# Altium schematic sheet PD.SchDoc
size A0; SheetNumber: 3; SheetTotal: 6
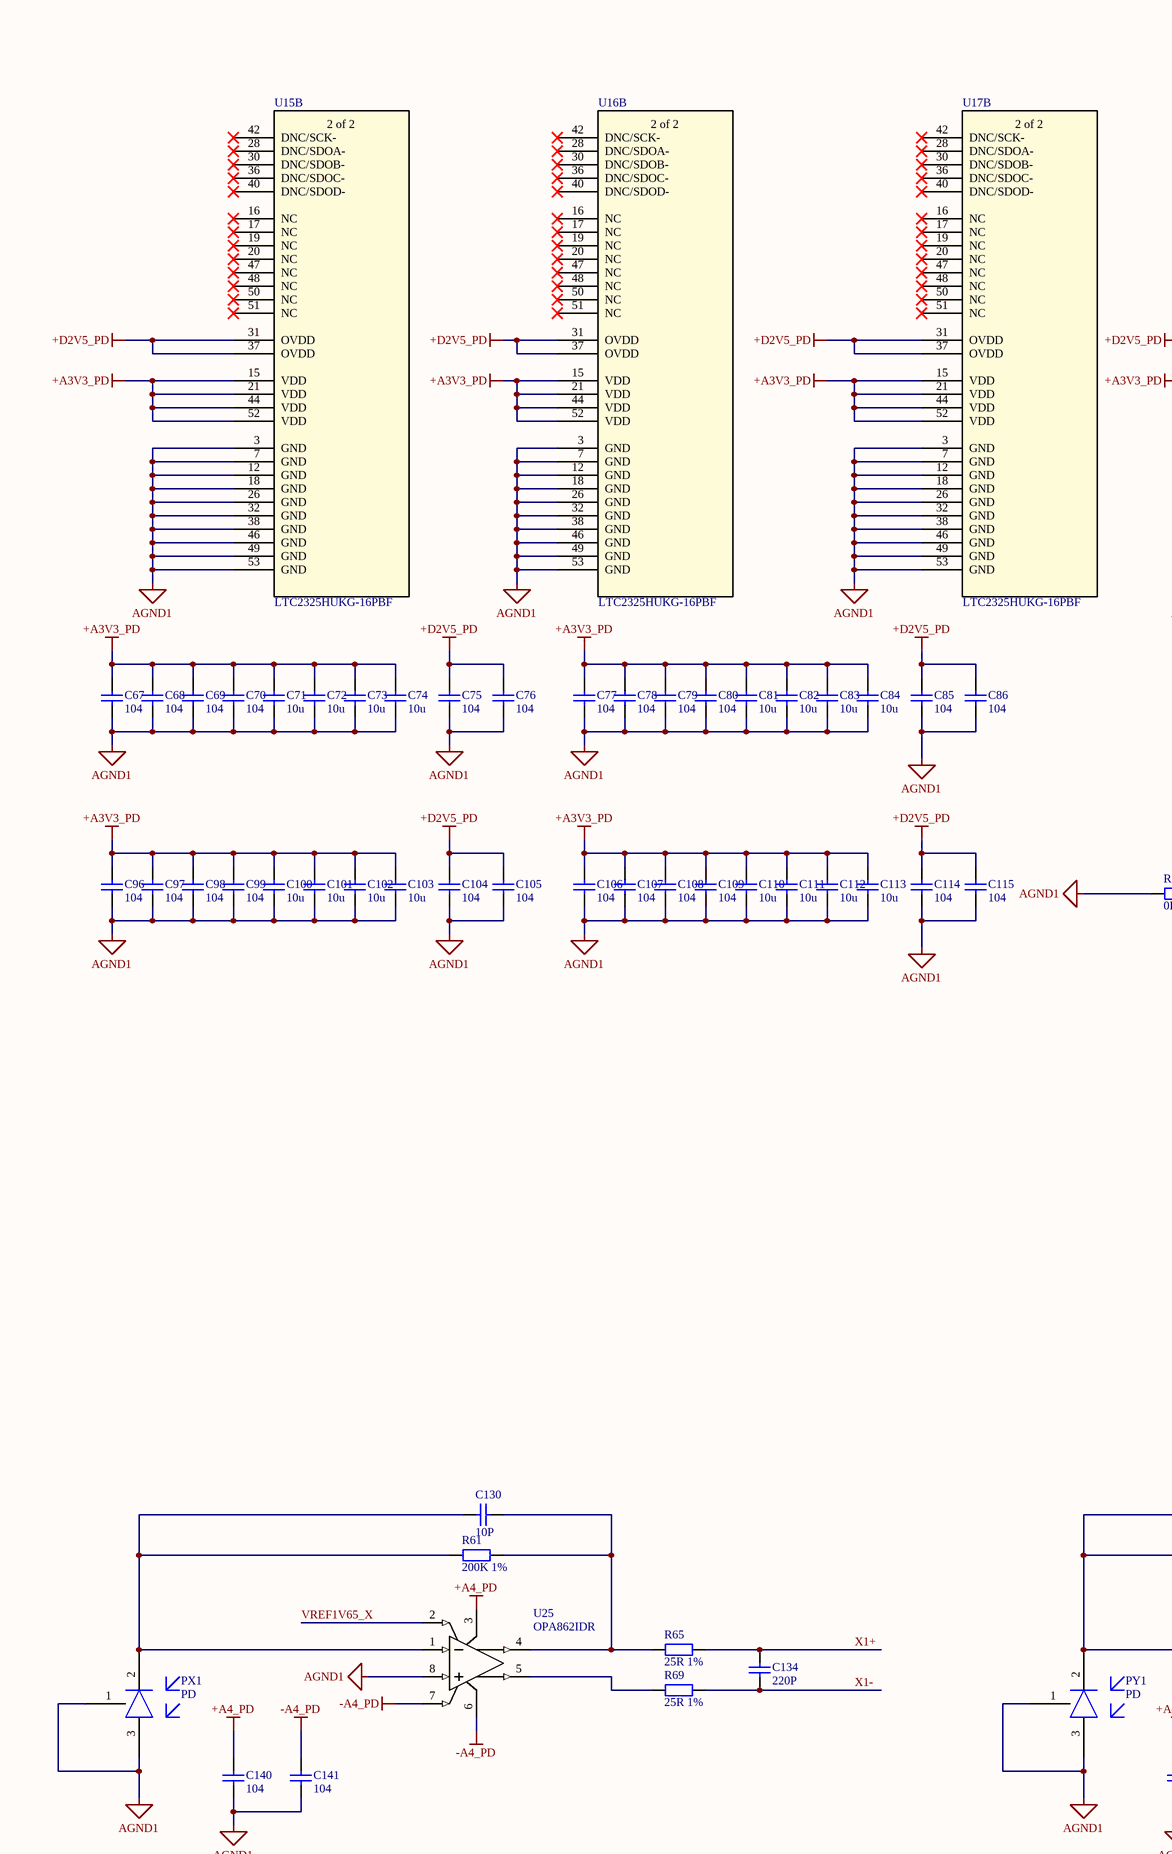
[diagram p0: PD.SchDoc, top left]
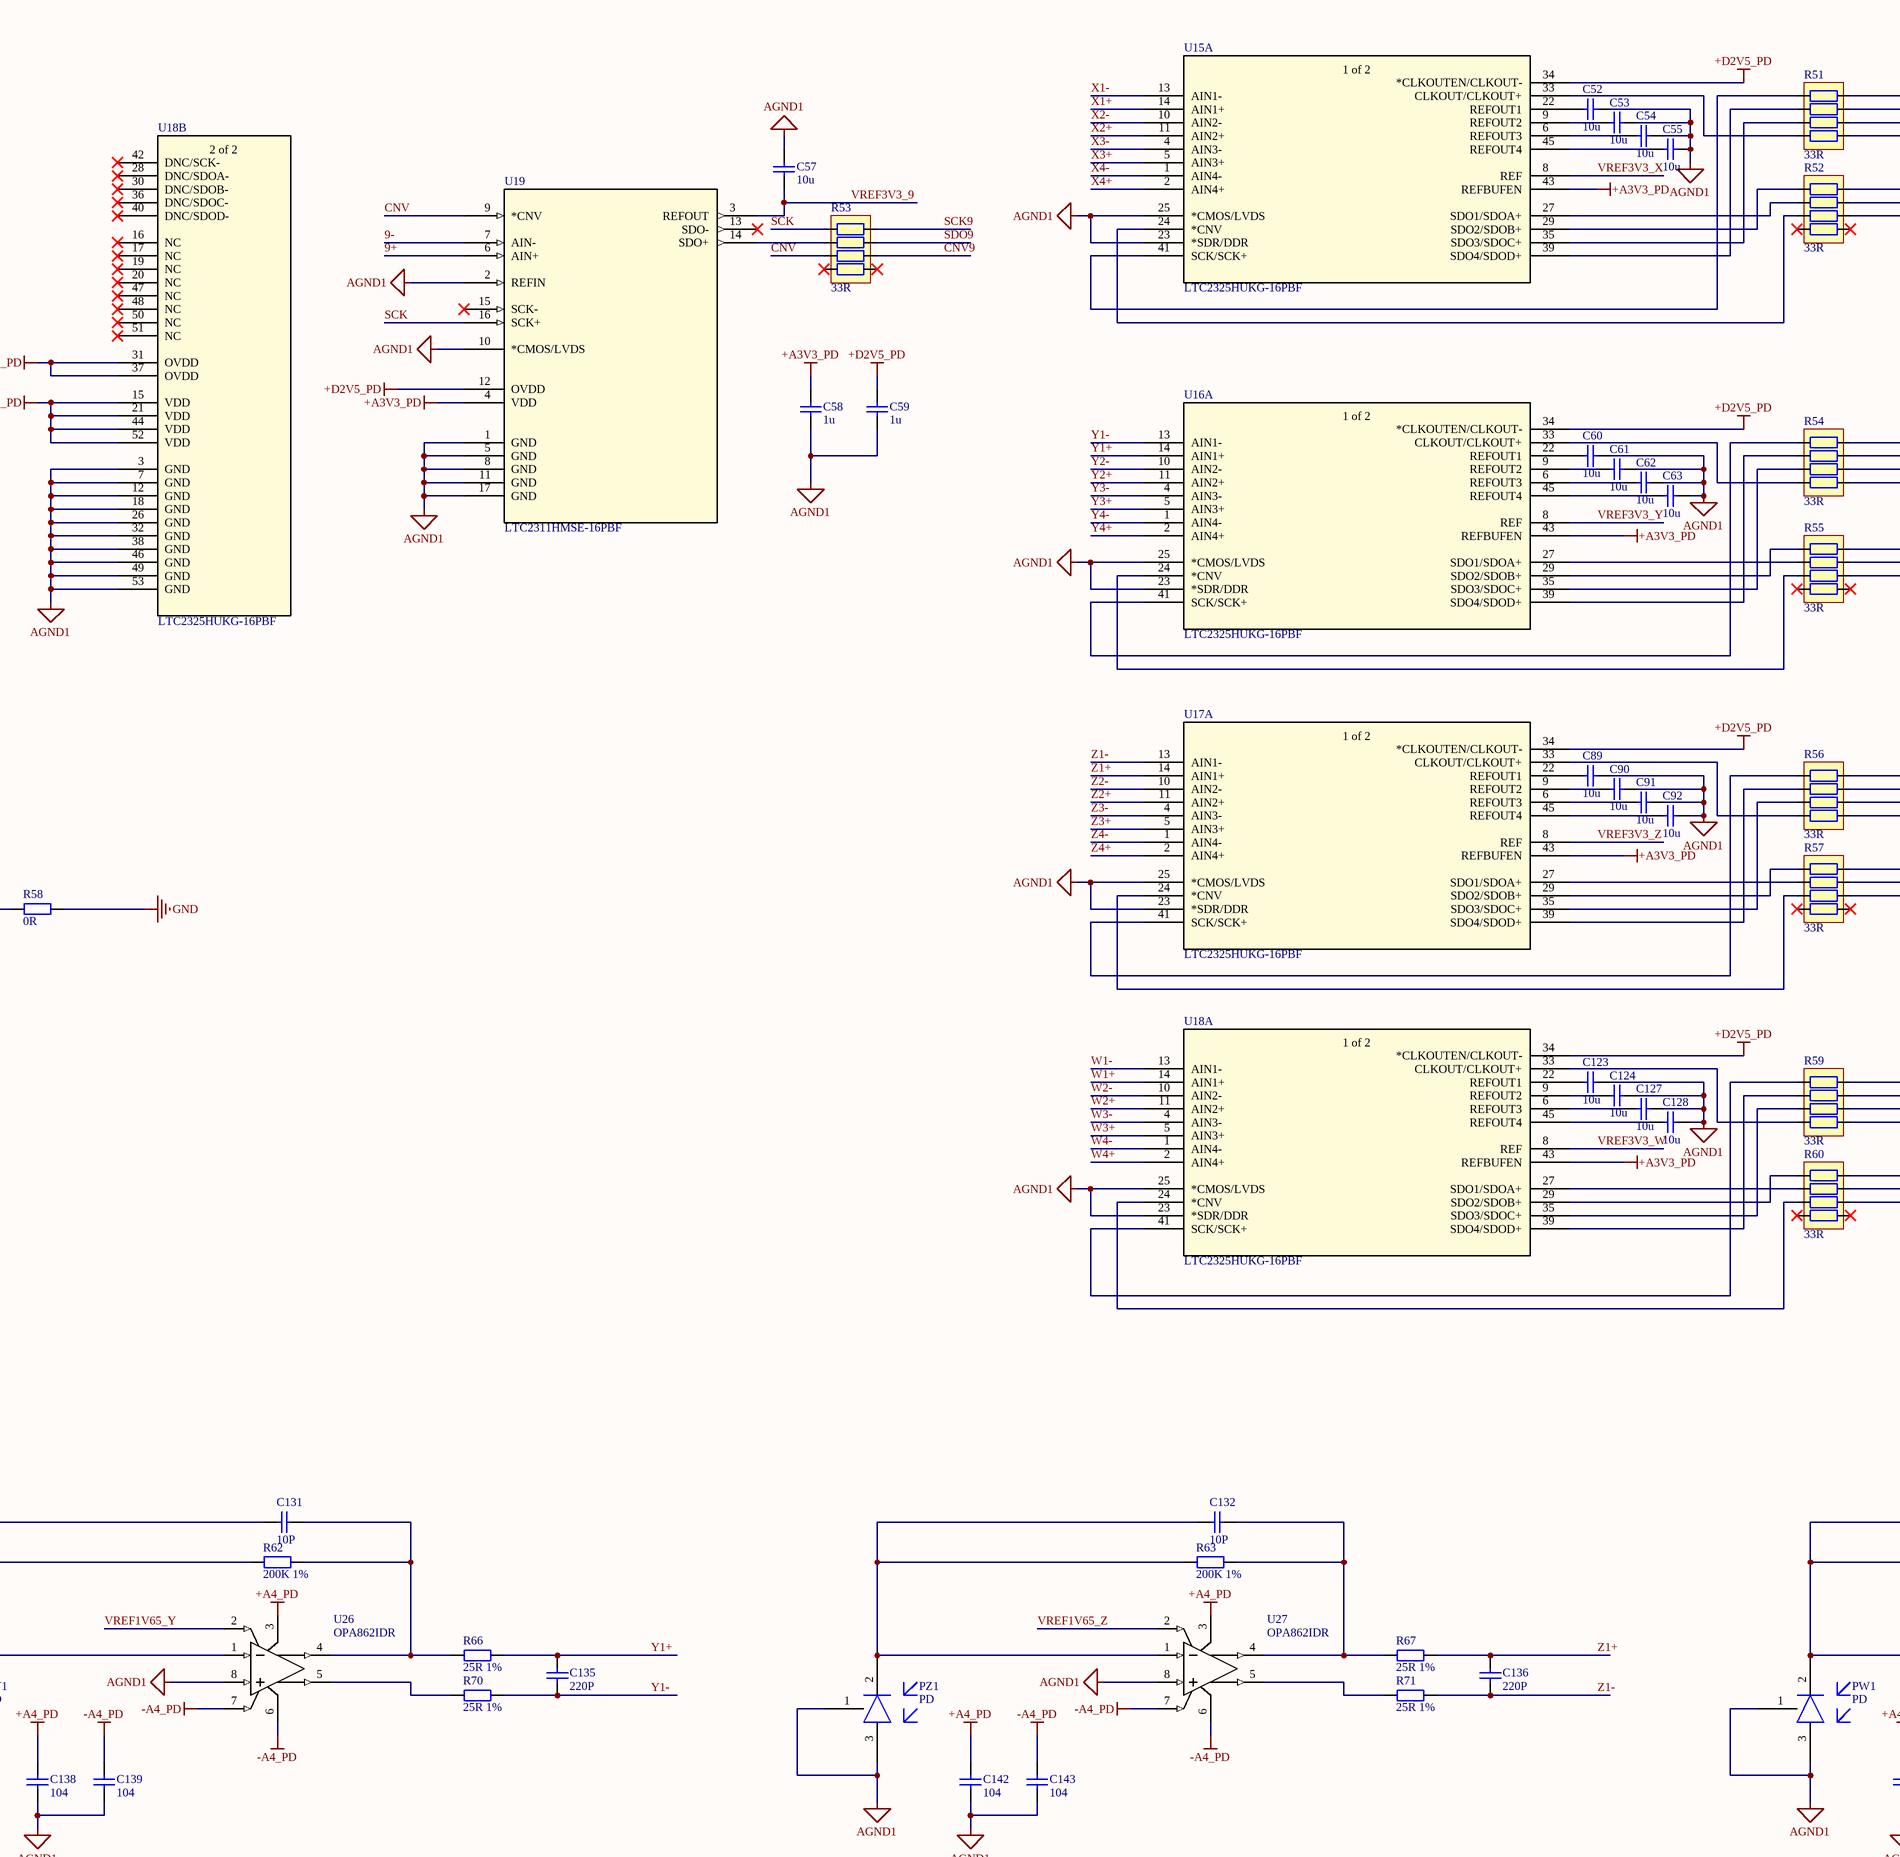
[diagram p1: PD.SchDoc, top middle]
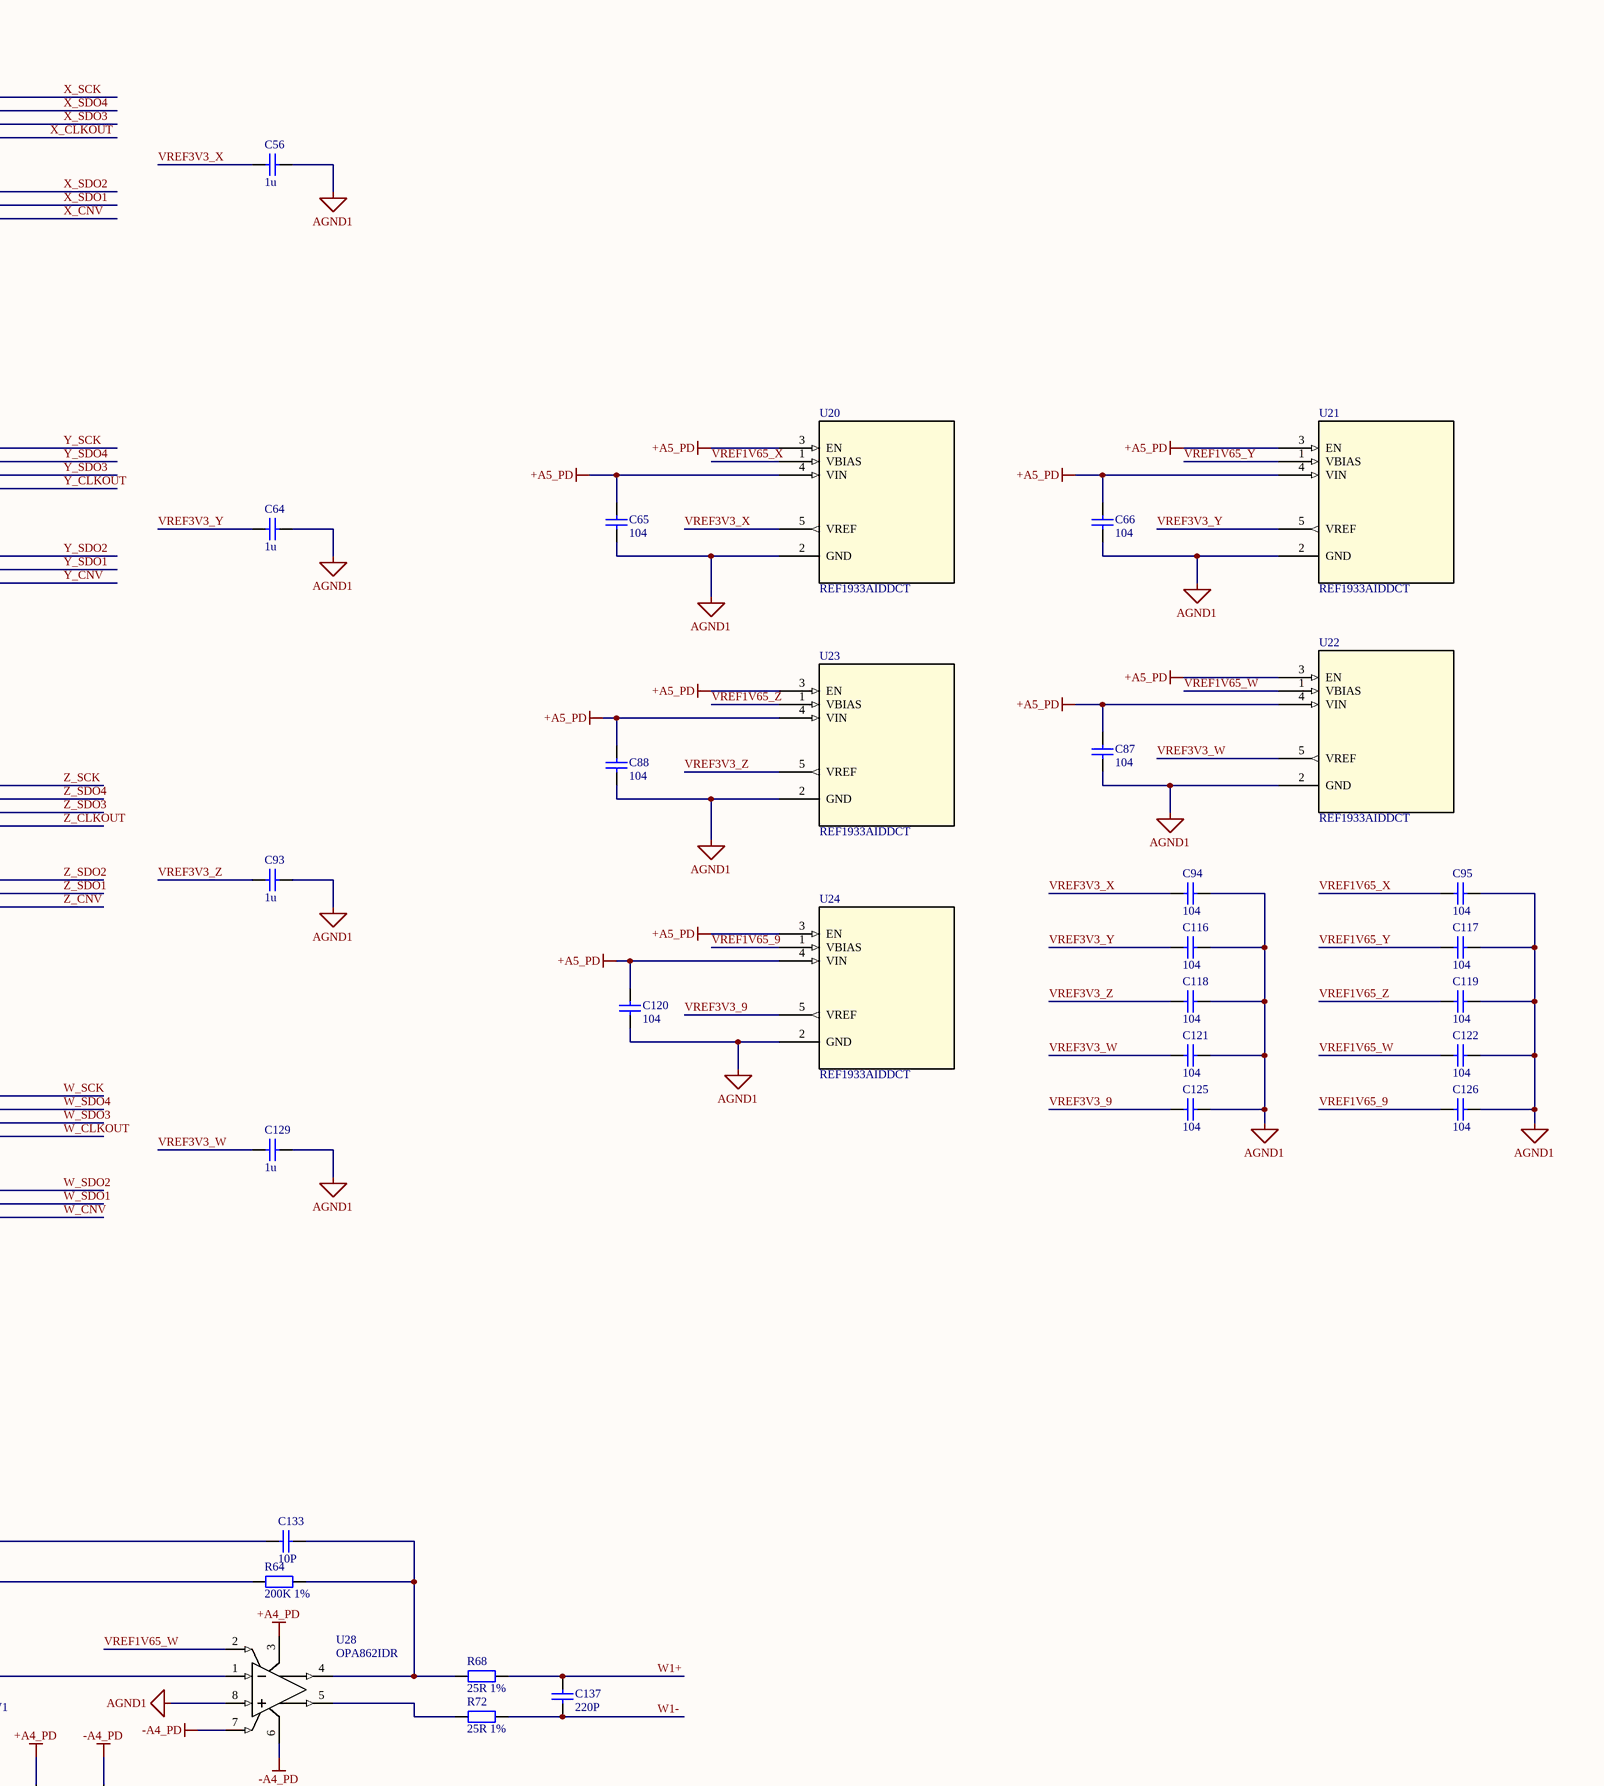
[diagram p2: PD.SchDoc, top right]
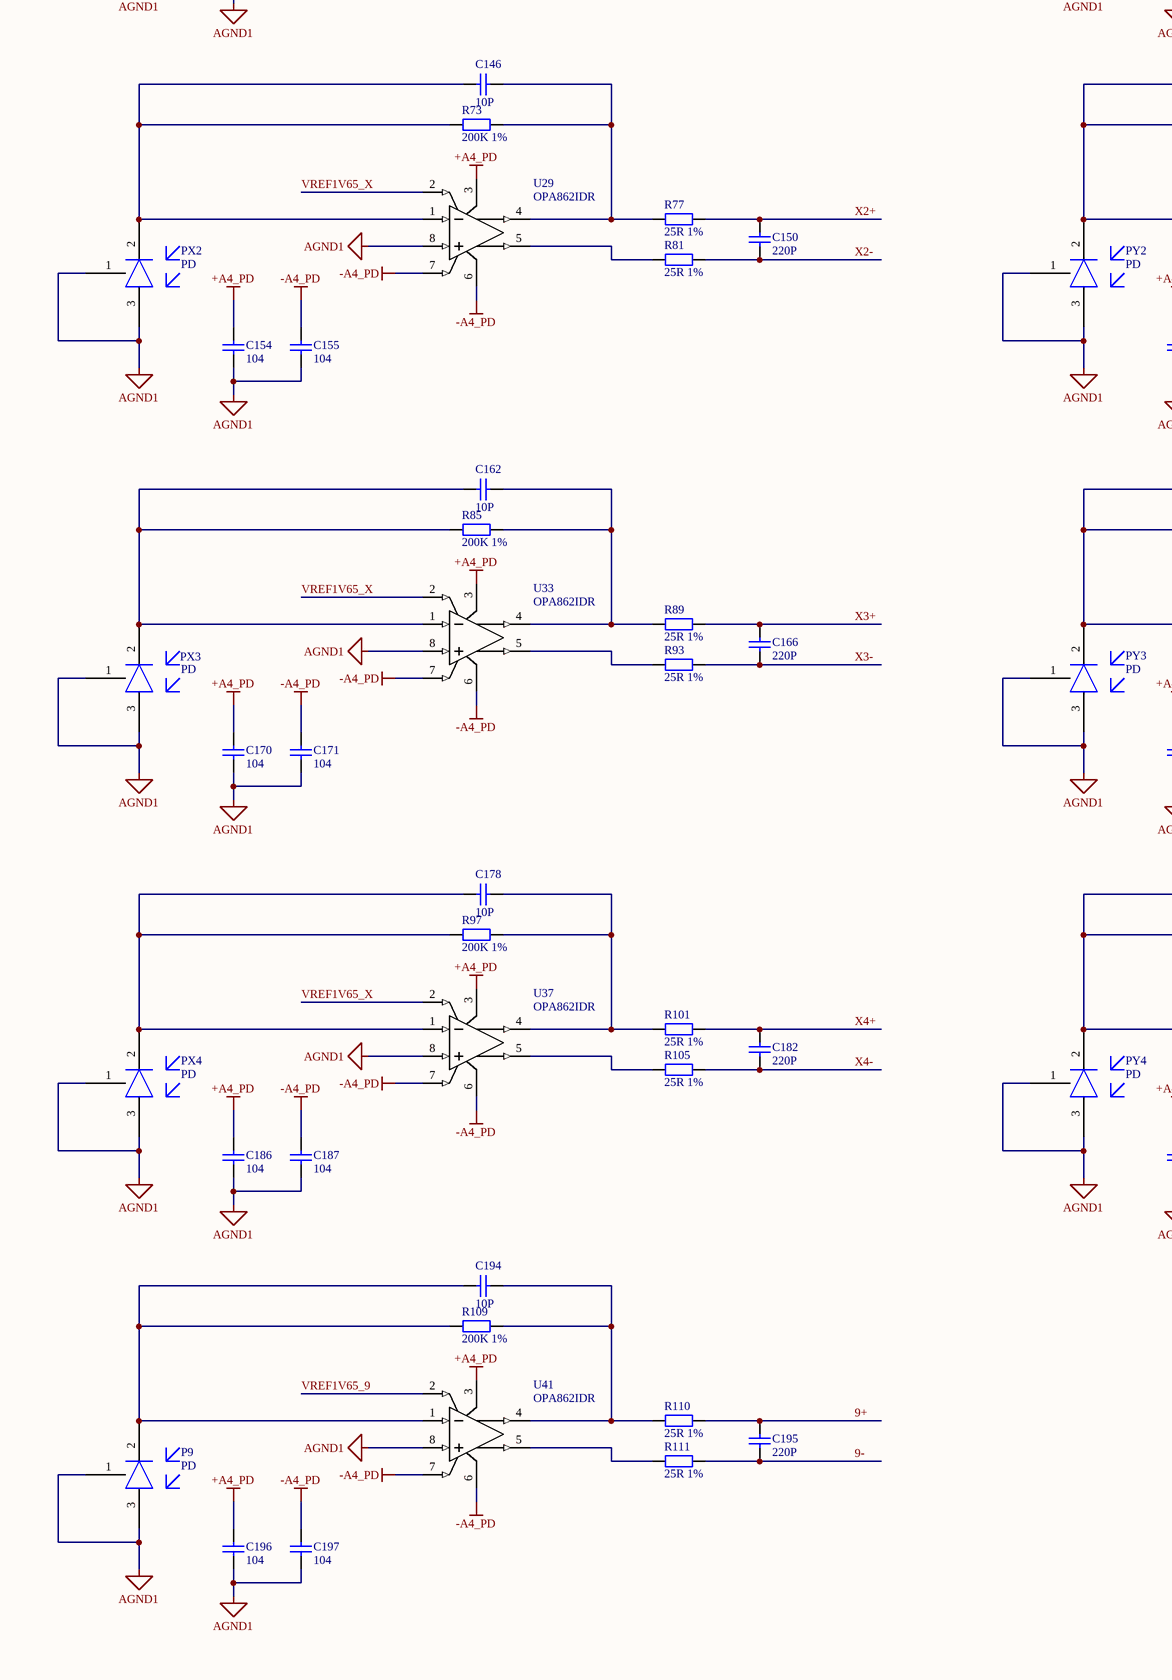
[diagram p3: PD.SchDoc, bottom left]
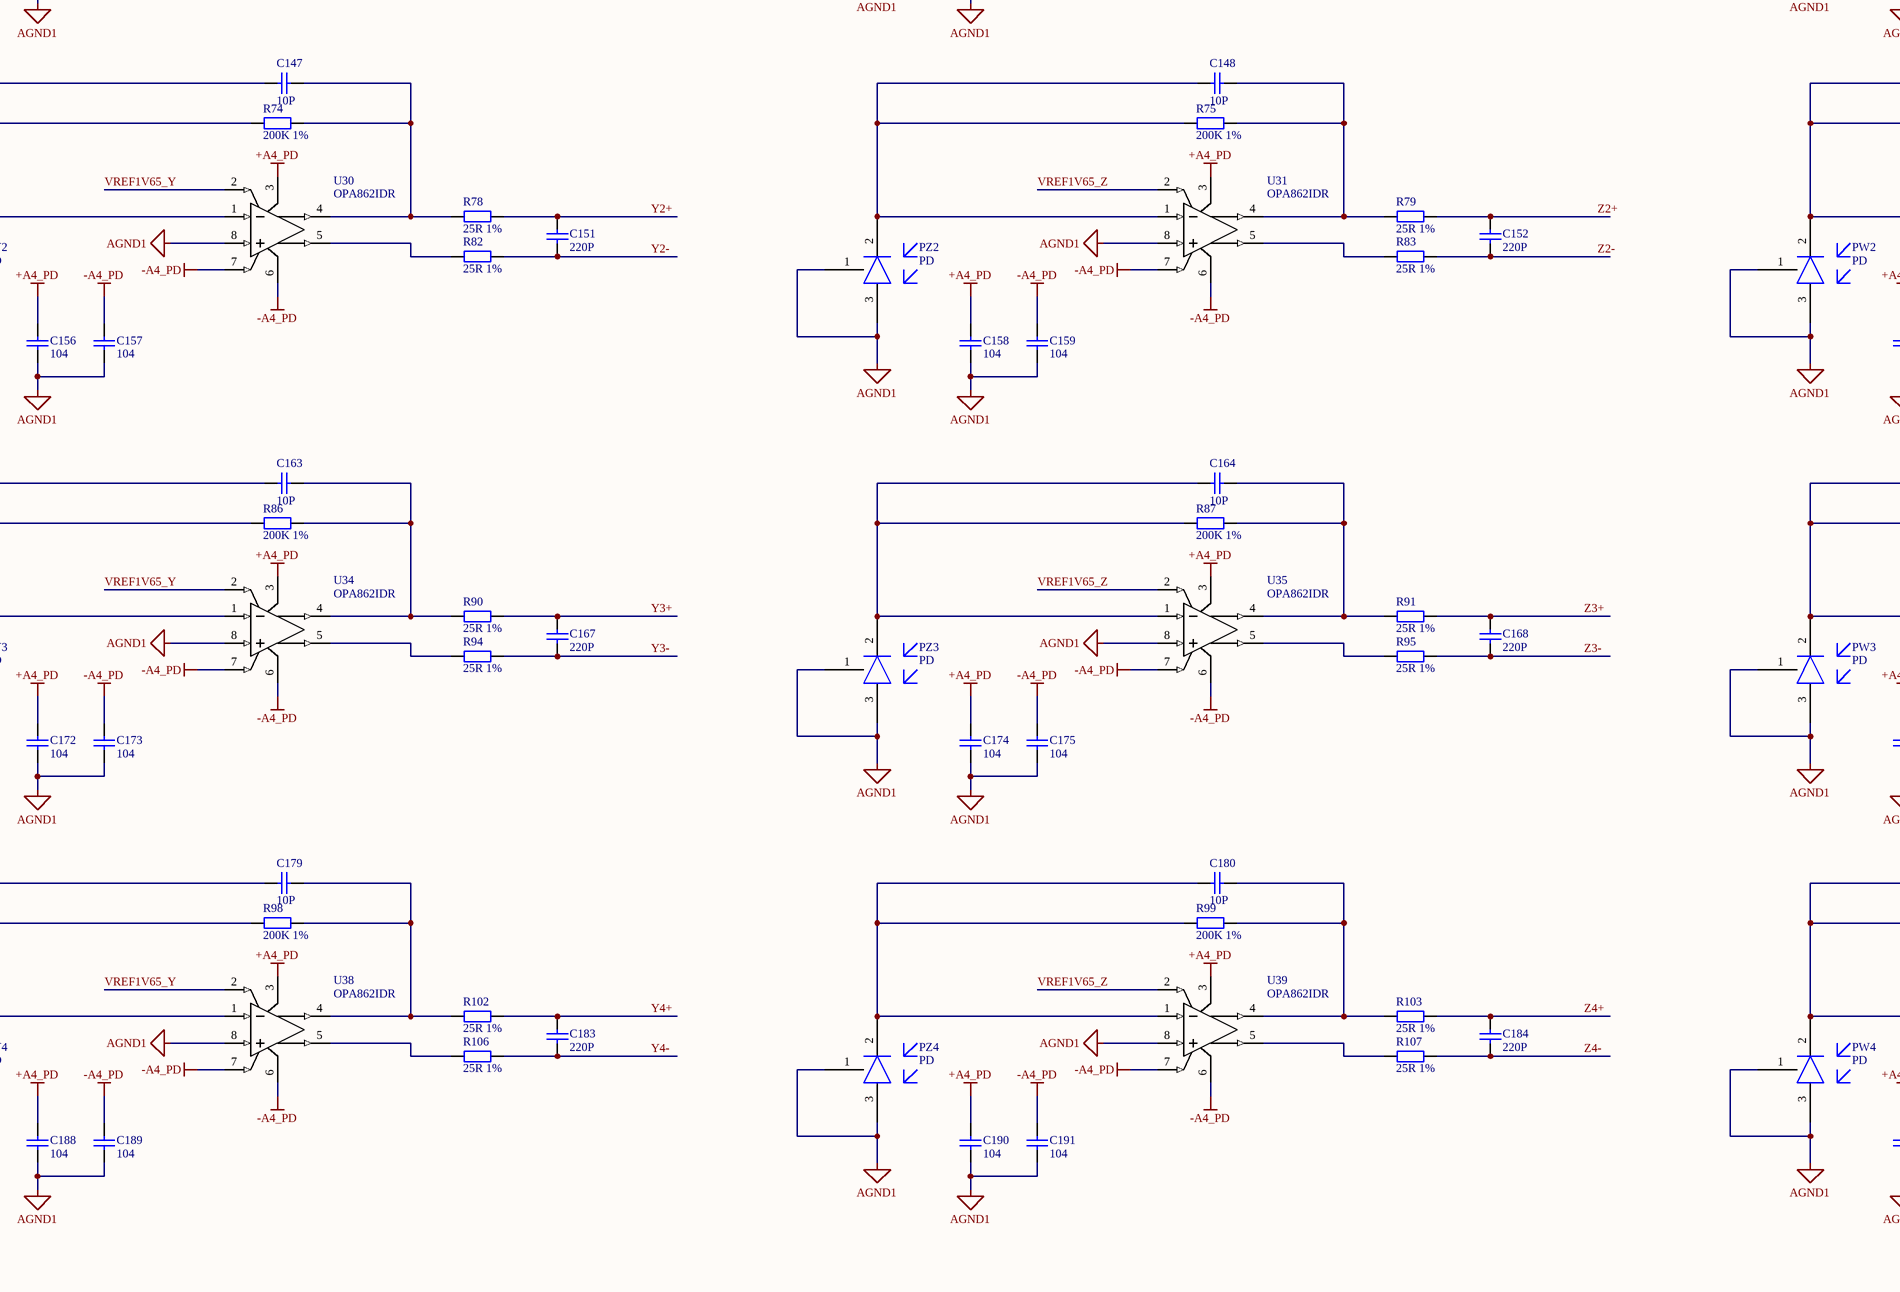
[diagram p4: PD.SchDoc, bottom middle]
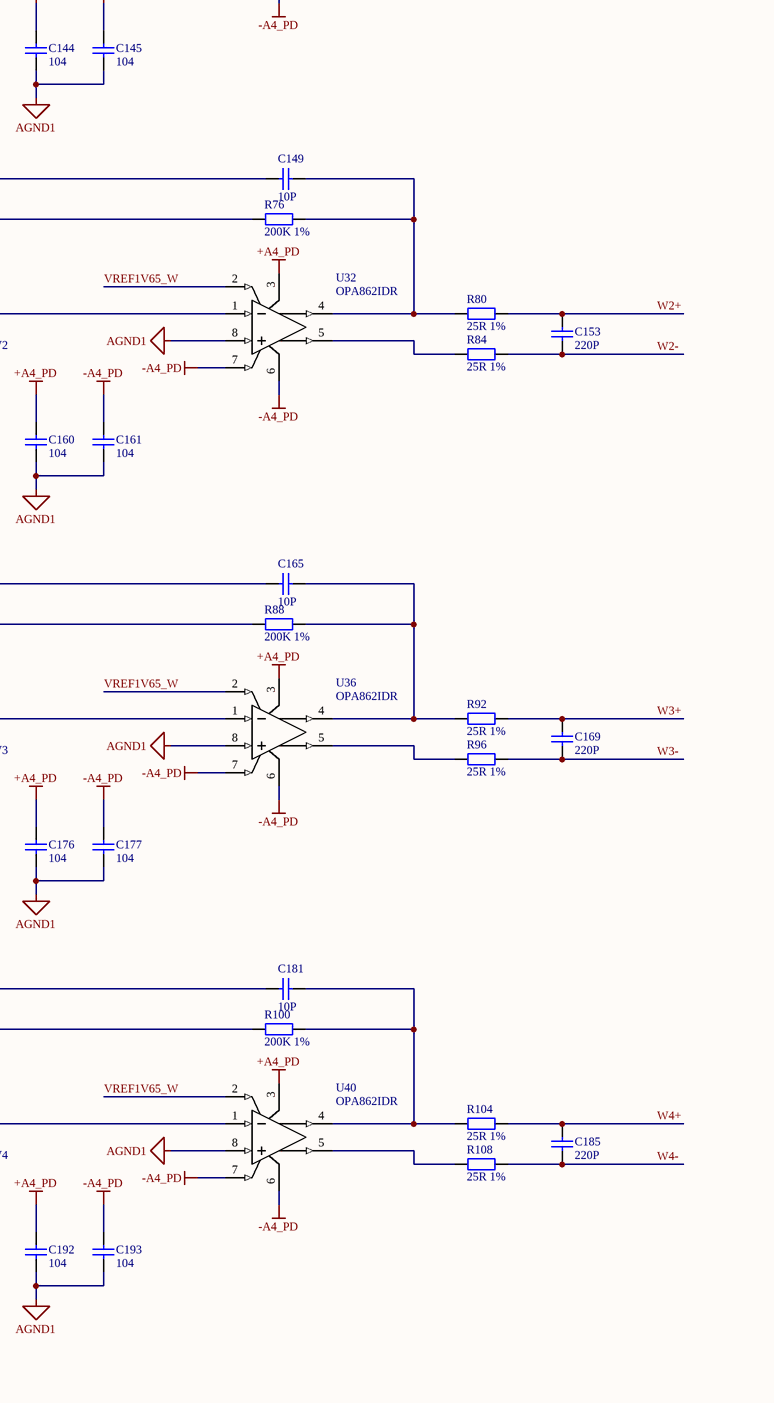
[diagram p5: PD.SchDoc, bottom right]

## Parts
C52  10u  [C0805_L]
C53  10u  [C0805_L]
C54  10u  [C0805_L]
C55  10u  [C0805_L]
C56  1u  [C0805_L]
C57  10u  [C0805_L]
C58  1u  [C0402_L]
C59  1u  [C0402_L]
C60  10u  [C0805_L]
C61  10u  [C0805_L]
C62  10u  [C0805_L]
C63  10u  [C0805_L]
C64  1u  [C0805_L]
C65  104  [C0402_L]
C66  104  [C0402_L]
C67  104  [C0402_L]
C68  104  [C0402_L]
C69  104  [C0402_L]
C70  104  [C0402_L]
C71  10u  [C0402_L]
C72  10u  [C0402_L]
C73  10u  [C0402_L]
C74  10u  [C0402_L]
C75  104  [C0402_L]
C76  104  [C0402_L]
C77  104  [C0402_L]
C78  104  [C0402_L]
C79  104  [C0402_L]
C80  104  [C0402_L]
C81  10u  [C0402_L]
C82  10u  [C0402_L]
C83  10u  [C0402_L]
C84  10u  [C0402_L]
C85  104  [C0402_L]
C86  104  [C0402_L]
C87  104  [C0402_L]
C88  104  [C0402_L]
C89  10u  [C0805_L]
C90  10u  [C0805_L]
C91  10u  [C0805_L]
C92  10u  [C0805_L]
C93  1u  [C0805_L]
C94  104  [C0402_L]
C95  104  [C0402_L]
C96  104  [C0402_L]
C97  104  [C0402_L]
C98  104  [C0402_L]
C99  104  [C0402_L]
C100  10u  [C0402_L]
C101  10u  [C0402_L]
C102  10u  [C0402_L]
C103  10u  [C0402_L]
C104  104  [C0402_L]
C105  104  [C0402_L]
C106  104  [C0402_L]
C107  104  [C0402_L]
C108  104  [C0402_L]
C109  104  [C0402_L]
C110  10u  [C0402_L]
C111  10u  [C0402_L]
C112  10u  [C0402_L]
C113  10u  [C0402_L]
C114  104  [C0402_L]
C115  104  [C0402_L]
C116  104  [C0402_L]
C117  104  [C0402_L]
C118  104  [C0402_L]
C119  104  [C0402_L]
C120  104  [C0402_L]
C121  104  [C0402_L]
C122  104  [C0402_L]
C123  10u  [C0805_L]
C124  10u  [C0805_L]
C125  104  [C0402_L]
C126  104  [C0402_L]
C127  10u  [C0805_L]
C128  10u  [C0805_L]
C129  1u  [C0805_L]
C130  10P  [C0402_L]
C131  10P  [C0402_L]
C132  10P  [C0402_L]
C133  10P  [C0402_L]
C134  220P  [C0402_L]
C135  220P  [C0402_L]
C136  220P  [C0402_L]
C137  220P  [C0402_L]
C138  104  [C0402_L]
C139  104  [C0402_L]
C140  104  [C0402_L]
C141  104  [C0402_L]
C142  104  [C0402_L]
C143  104  [C0402_L]
C144  104  [C0402_L]
C145  104  [C0402_L]
C146  10P  [C0402_L]
C147  10P  [C0402_L]
C148  10P  [C0402_L]
C149  10P  [C0402_L]
C150  220P  [C0402_L]
C151  220P  [C0402_L]
C152  220P  [C0402_L]
C153  220P  [C0402_L]
C154  104  [C0402_L]
C155  104  [C0402_L]
C156  104  [C0402_L]
C157  104  [C0402_L]
C158  104  [C0402_L]
C159  104  [C0402_L]
C160  104  [C0402_L]
C161  104  [C0402_L]
C162  10P  [C0402_L]
C163  10P  [C0402_L]
C164  10P  [C0402_L]
C165  10P  [C0402_L]
C166  220P  [C0402_L]
C167  220P  [C0402_L]
C168  220P  [C0402_L]
C169  220P  [C0402_L]
C170  104  [C0402_L]
C171  104  [C0402_L]
C172  104  [C0402_L]
C173  104  [C0402_L]
C174  104  [C0402_L]
C175  104  [C0402_L]
C176  104  [C0402_L]
C177  104  [C0402_L]
C178  10P  [C0402_L]
C179  10P  [C0402_L]
C180  10P  [C0402_L]
C181  10P  [C0402_L]
C182  220P  [C0402_L]
C183  220P  [C0402_L]
C184  220P  [C0402_L]
C185  220P  [C0402_L]
C186  104  [C0402_L]
C187  104  [C0402_L]
C188  104  [C0402_L]
C189  104  [C0402_L]
C190  104  [C0402_L]
C191  104  [C0402_L]
C192  104  [C0402_L]
C193  104  [C0402_L]
C194  10P  [C0402_L]
C195  220P  [C0402_L]
C196  104  [C0402_L]
C197  104  [C0402_L]
P9  PD  [PD]
PW1  PD  [PD]
PW2  PD  [PD]
PW3  PD  [PD]
PW4  PD  [PD]
PX1  PD  [PD]
PX2  PD  [PD]
PX3  PD  [PD]
PX4  PD  [PD]
PY1  PD  [PD]
PY2  PD  [PD]
PY3  PD  [PD]
PY4  PD  [PD]
PZ1  PD  [PD]
PZ2  PD  [PD]
PZ3  PD  [PD]
PZ4  PD  [PD]
R51  33R  [RCA-8P4R-0402]
R52  33R  [RCA-8P4R-0402]
R53  33R  [RCA-8P4R-0402]
R54  33R  [RCA-8P4R-0402]
R55  33R  [RCA-8P4R-0402]
R56  33R  [RCA-8P4R-0402]
R57  33R  [RCA-8P4R-0402]
R58  0R  [R0402_L]
R59  33R  [RCA-8P4R-0402]
R60  33R  [RCA-8P4R-0402]
R61  200K 1%  [R0402_L]
R62  200K 1%  [R0402_L]
R63  200K 1%  [R0402_L]
R64  200K 1%  [R0402_L]
R65  25R 1%  [R0402_L]
R66  25R 1%  [R0402_L]
R67  25R 1%  [R0402_L]
R68  25R 1%  [R0402_L]
R69  25R 1%  [R0402_L]
R70  25R 1%  [R0402_L]
R71  25R 1%  [R0402_L]
R72  25R 1%  [R0402_L]
R73  200K 1%  [R0402_L]
R74  200K 1%  [R0402_L]
R75  200K 1%  [R0402_L]
R76  200K 1%  [R0402_L]
R77  25R 1%  [R0402_L]
R78  25R 1%  [R0402_L]
R79  25R 1%  [R0402_L]
R80  25R 1%  [R0402_L]
R81  25R 1%  [R0402_L]
R82  25R 1%  [R0402_L]
R83  25R 1%  [R0402_L]
R84  25R 1%  [R0402_L]
R85  200K 1%  [R0402_L]
R86  200K 1%  [R0402_L]
R87  200K 1%  [R0402_L]
R88  200K 1%  [R0402_L]
R89  25R 1%  [R0402_L]
R90  25R 1%  [R0402_L]
R91  25R 1%  [R0402_L]
R92  25R 1%  [R0402_L]
R93  25R 1%  [R0402_L]
R94  25R 1%  [R0402_L]
R95  25R 1%  [R0402_L]
R96  25R 1%  [R0402_L]
R97  200K 1%  [R0402_L]
R98  200K 1%  [R0402_L]
R99  200K 1%  [R0402_L]
R100  200K 1%  [R0402_L]
R101  25R 1%  [R0402_L]
R102  25R 1%  [R0402_L]
R103  25R 1%  [R0402_L]
R104  25R 1%  [R0402_L]
R105  25R 1%  [R0402_L]
R106  25R 1%  [R0402_L]
R107  25R 1%  [R0402_L]
R108  25R 1%  [R0402_L]
R109  200K 1%  [R0402_L]
R110  25R 1%  [R0402_L]
R111  25R 1%  [R0402_L]
U15  LTC2325HUKG-16PBF  [UKG_52A_ADI]  (parts A,B of 2)
U16  LTC2325HUKG-16PBF  [UKG_52A_ADI]  (parts A,B of 2)
U17  LTC2325HUKG-16PBF  [UKG_52A_ADI]  (parts A,B of 2)
U18  LTC2325HUKG-16PBF  [UKG_52A_ADI]  (parts A,B of 2)
U19  LTC2311HMSE-16PBF  [MSE_16_ADI]
U20  REF1933AIDDCT  [DDC5_TEX]
U21  REF1933AIDDCT  [DDC5_TEX]
U22  REF1933AIDDCT  [DDC5_TEX]
U23  REF1933AIDDCT  [DDC5_TEX]
U24  REF1933AIDDCT  [DDC5_TEX]
U25  OPA862IDR  [SOIC-8]
U26  OPA862IDR  [SOIC-8]
U27  OPA862IDR  [SOIC-8]
U28  OPA862IDR  [SOIC-8]
U29  OPA862IDR  [SOIC-8]
U30  OPA862IDR  [SOIC-8]
U31  OPA862IDR  [SOIC-8]
U32  OPA862IDR  [SOIC-8]
U33  OPA862IDR  [SOIC-8]
U34  OPA862IDR  [SOIC-8]
U35  OPA862IDR  [SOIC-8]
U36  OPA862IDR  [SOIC-8]
U37  OPA862IDR  [SOIC-8]
U38  OPA862IDR  [SOIC-8]
U39  OPA862IDR  [SOIC-8]
U40  OPA862IDR  [SOIC-8]
U41  OPA862IDR  [SOIC-8]

## Nets
+A3V3_PD: C58.1 C67.1 C68.1 C69.1 C70.1 C71.1 C72.1 C73.1 C74.1 C77.1 C78.1 C79.1 C80.1 C81.1 C82.1 C83.1 C84.1 C96.1 C97.1 C98.1 C99.1 C100.1 C101.1 C102.1 C103.1 C106.1 C107.1 C108.1 C109.1 C110.1 C111.1 C112.1 C113.1 U15.15(VDD) U15.21(VDD) U15.43(REFBUFEN) U15.44(VDD) U15.52(VDD) U16.15(VDD) U16.21(VDD) U16.43(REFBUFEN) U16.44(VDD) U16.52(VDD) U17.15(VDD) U17.21(VDD) U17.43(REFBUFEN) U17.44(VDD) U17.52(VDD) U18.15(VDD) U18.21(VDD) U18.43(REFBUFEN) U18.44(VDD) U18.52(VDD) U19.4(VDD)
+A4_PD: C138.1 C140.1 C142.1 C144.1 C154.1 C156.1 C158.1 C160.1 C170.1 C172.1 C174.1 C176.1 C186.1 C188.1 C190.1 C192.1 C196.1 U25.3(VS+) U26.3(VS+) U27.3(VS+) U28.3(VS+) U29.3(VS+) U30.3(VS+) U31.3(VS+) U32.3(VS+) U33.3(VS+) U34.3(VS+) U35.3(VS+) U36.3(VS+) U37.3(VS+) U38.3(VS+) U39.3(VS+) U40.3(VS+) U41.3(VS+)
+A5_PD: C65.2 C66.2 C87.2 C88.2 C120.2 U20.3(EN) U20.4(VIN) U21.3(EN) U21.4(VIN) U22.3(EN) U22.4(VIN) U23.3(EN) U23.4(VIN) U24.3(EN) U24.4(VIN)
+D2V5_PD: C59.1 C75.1 C76.1 C85.1 C86.1 C104.1 C105.1 C114.1 C115.1 U15.31(OVDD) U15.34(*CLKOUTEN/CLKOUT-) U15.37(OVDD) U16.31(OVDD) U16.34(*CLKOUTEN/CLKOUT-) U16.37(OVDD) U17.31(OVDD) U17.34(*CLKOUTEN/CLKOUT-) U17.37(OVDD) U18.31(OVDD) U18.34(*CLKOUTEN/CLKOUT-) U18.37(OVDD) U19.12(OVDD)
-A4_PD: C139.1 C141.1 C143.1 C145.1 C155.1 C157.1 C159.1 C161.1 C171.1 C173.1 C175.1 C177.1 C187.1 C189.1 C191.1 C193.1 C197.1 U25.6(VS-) U25.7(PD_N) U26.6(VS-) U26.7(PD_N) U27.6(VS-) U27.7(PD_N) U28.6(VS-) U28.7(PD_N) U29.6(VS-) U29.7(PD_N) U30.6(VS-) U30.7(PD_N) U31.6(VS-) U31.7(PD_N) U32.6(VS-) U32.7(PD_N) U33.6(VS-) U33.7(PD_N) U34.6(VS-) U34.7(PD_N) U35.6(VS-) U35.7(PD_N) U36.6(VS-) U36.7(PD_N) U37.6(VS-) U37.7(PD_N) U38.6(VS-) U38.7(PD_N) U39.6(VS-) U39.7(PD_N) U40.6(VS-) U40.7(PD_N) U41.6(VS-) U41.7(PD_N)
AGND1: C52.2 C53.2 C54.2 C55.2 C56.1 C57.2 C58.2 C59.2 C60.2 C61.2 C62.2 C63.2 C64.1 C65.1 C66.1 C67.2 C68.2 C69.2 C70.2 C71.2 C72.2 C73.2 C74.2 C75.2 C76.2 C77.2 C78.2 C79.2 C80.2 C81.2 C82.2 C83.2 C84.2 C85.2 C86.2 C87.1 C88.1 C89.2 C90.2 C91.2 C92.2 C93.1 C94.1 C95.1 C96.2 C97.2 C98.2 C99.2 C100.2 C101.2 C102.2 C103.2 C104.2 C105.2 C106.2 C107.2 C108.2 C109.2 C110.2 C111.2 C112.2 C113.2 C114.2 C115.2 C116.1 C117.1 C118.1 C119.1 C120.1 C121.1 C122.1 C123.2 C124.2 C125.1 C126.1 C127.2 C128.2 C129.1 C138.2 C139.2 C140.2 C141.2 C142.2 C143.2 C144.2 C145.2 C154.2 C155.2 C156.2 C157.2 C158.2 C159.2 C160.2 C161.2 C170.2 C171.2 C172.2 C173.2 C174.2 C175.2 C176.2 C177.2 C186.2 C187.2 C188.2 C189.2 C190.2 C191.2 C192.2 C193.2 C196.2 C197.2 P9.1 P9.3 PW1.1 PW1.3 PW2.1 PW2.3 PW3.1 PW3.3 PW4.1 PW4.3 PX1.1 PX1.3 PX2.1 PX2.3 PX3.1 PX3.3 PX4.1 PX4.3 PY1.1 PY1.3 PY2.1 PY2.3 PY3.1 PY3.3 PY4.1 PY4.3 PZ1.1 PZ1.3 PZ2.1 PZ2.3 PZ3.1 PZ3.3 PZ4.1 PZ4.3 R58.1 U15.3(GND) U15.7(GND) U15.12(GND) U15.18(GND) U15.23(*SDR/DDR) U15.25(*CMOS/LVDS) U15.26(GND) U15.32(GND) U15.38(GND) U15.46(GND) U15.49(GND) U15.53(GND) U16.3(GND) U16.7(GND) U16.12(GND) U16.18(GND) U16.23(*SDR/DDR) U16.25(*CMOS/LVDS) U16.26(GND) U16.32(GND) U16.38(GND) U16.46(GND) U16.49(GND) U16.53(GND) U17.3(GND) U17.7(GND) U17.12(GND) U17.18(GND) U17.23(*SDR/DDR) U17.25(*CMOS/LVDS) U17.26(GND) U17.32(GND) U17.38(GND) U17.46(GND) U17.49(GND) U17.53(GND) U18.3(GND) U18.7(GND) U18.12(GND) U18.18(GND) U18.23(*SDR/DDR) U18.25(*CMOS/LVDS) U18.26(GND) U18.32(GND) U18.38(GND) U18.46(GND) U18.49(GND) U18.53(GND) U19.1(GND) U19.2(REFIN) U19.5(GND) U19.8(GND) U19.10(*CMOS/LVDS) U19.11(GND) U19.17(GND) U20.2(GND) U21.2(GND) U22.2(GND) U23.2(GND) U24.2(GND) U25.8(VIN+) U26.8(VIN+) U27.8(VIN+) U28.8(VIN+) U29.8(VIN+) U30.8(VIN+) U31.8(VIN+) U32.8(VIN+) U33.8(VIN+) U34.8(VIN+) U35.8(VIN+) U36.8(VIN+) U37.8(VIN+) U38.8(VIN+) U39.8(VIN+) U40.8(VIN+) U41.8(VIN+)
GND: R58.2
9+: C195.2 R110.2 U19.6(AIN+)
9-: C195.1 R111.2 U19.7(AIN-)
CNV: R53.3 U19.9(*CNV)
CNV9: R53.6
SCK: R53.1 U19.16(SCK+)
SCK9: R53.8
SDO9: R53.7
VREF1V65_9: C126.2 U24.1(VBIAS) U41.2(VOCM)
VREF1V65_W: C122.2 U22.1(VBIAS) U28.2(VOCM) U32.2(VOCM) U36.2(VOCM) U40.2(VOCM)
VREF1V65_X: C95.2 U20.1(VBIAS) U25.2(VOCM) U29.2(VOCM) U33.2(VOCM) U37.2(VOCM)
VREF1V65_Y: C117.2 U21.1(VBIAS) U26.2(VOCM) U30.2(VOCM) U34.2(VOCM) U38.2(VOCM)
VREF1V65_Z: C119.2 U23.1(VBIAS) U27.2(VOCM) U31.2(VOCM) U35.2(VOCM) U39.2(VOCM)
VREF3V3_9: C57.1 C125.2 U19.3(REFOUT) U24.5(VREF)
VREF3V3_W: C121.2 C129.2 U18.8(REF) U22.5(VREF)
VREF3V3_X: C56.2 C94.2 U15.8(REF) U20.5(VREF)
VREF3V3_Y: C64.2 C116.2 U16.8(REF) U21.5(VREF)
VREF3V3_Z: C93.2 C118.2 U17.8(REF) U23.5(VREF)
W1+: C137.2 R68.2 U18.14(AIN1+)
W1-: C137.1 R72.2 U18.13(AIN1-)
W2+: C153.2 R80.2 U18.11(AIN2+)
W2-: C153.1 R84.2 U18.10(AIN2-)
W3+: C169.2 R92.2 U18.5(AIN3+)
W3-: C169.1 R96.2 U18.4(AIN3-)
W4+: C185.2 R104.2 U18.2(AIN4+)
W4-: C185.1 R108.2 U18.1(AIN4-)
W_CLKOUT: R59.5
W_CNV: R60.6
W_SCK: R59.8
W_SDO1: R60.7
W_SDO2: R60.8
W_SDO3: R59.6
W_SDO4: R59.7
X1+: C134.2 R65.2 U15.14(AIN1+)
X1-: C134.1 R69.2 U15.13(AIN1-)
X2+: C150.2 R77.2 U15.11(AIN2+)
X2-: C150.1 R81.2 U15.10(AIN2-)
X3+: C166.2 R89.2 U15.5(AIN3+)
X3-: C166.1 R93.2 U15.4(AIN3-)
X4+: C182.2 R101.2 U15.2(AIN4+)
X4-: C182.1 R105.2 U15.1(AIN4-)
X_CLKOUT: R51.5
X_CNV: R52.6
X_SCK: R51.8
X_SDO1: R52.7
X_SDO2: R52.8
X_SDO3: R51.6
X_SDO4: R51.7
Y1+: C135.2 R66.2 U16.14(AIN1+)
Y1-: C135.1 R70.2 U16.13(AIN1-)
Y2+: C151.2 R78.2 U16.11(AIN2+)
Y2-: C151.1 R82.2 U16.10(AIN2-)
Y3+: C167.2 R90.2 U16.5(AIN3+)
Y3-: C167.1 R94.2 U16.4(AIN3-)
Y4+: C183.2 R102.2 U16.2(AIN4+)
Y4-: C183.1 R106.2 U16.1(AIN4-)
Y_CLKOUT: R54.5
Y_CNV: R55.6
Y_SCK: R54.8
Y_SDO1: R55.7
Y_SDO2: R55.8
Y_SDO3: R54.6
Y_SDO4: R54.7
Z1+: C136.2 R67.2 U17.14(AIN1+)
Z1-: C136.1 R71.2 U17.13(AIN1-)
Z2+: C152.2 R79.2 U17.11(AIN2+)
Z2-: C152.1 R83.2 U17.10(AIN2-)
Z3+: C168.2 R91.2 U17.5(AIN3+)
Z3-: C168.1 R95.2 U17.4(AIN3-)
Z4+: C184.2 R103.2 U17.2(AIN4+)
Z4-: C184.1 R107.2 U17.1(AIN4-)
Z_CLKOUT: R56.5
Z_CNV: R57.6
Z_SCK: R56.8
Z_SDO1: R57.7
Z_SDO2: R57.8
Z_SDO3: R56.6
Z_SDO4: R56.7
NetC52_1: C52.1 U15.22(REFOUT1)
NetC53_1: C53.1 U15.9(REFOUT2)
NetC54_1: C54.1 U15.6(REFOUT3)
NetC55_1: C55.1 U15.45(REFOUT4)
NetC60_1: C60.1 U16.22(REFOUT1)
NetC61_1: C61.1 U16.9(REFOUT2)
NetC62_1: C62.1 U16.6(REFOUT3)
NetC63_1: C63.1 U16.45(REFOUT4)
NetC89_1: C89.1 U17.22(REFOUT1)
NetC90_1: C90.1 U17.9(REFOUT2)
NetC91_1: C91.1 U17.6(REFOUT3)
NetC92_1: C92.1 U17.45(REFOUT4)
NetC123_1: C123.1 U18.22(REFOUT1)
NetC124_1: C124.1 U18.9(REFOUT2)
NetC127_1: C127.1 U18.6(REFOUT3)
NetC128_1: C128.1 U18.45(REFOUT4)
NetC130_1: C130.1 PX1.2 R61.1 U25.1(VIN-)
NetC130_2: C130.2 R61.2 R65.1 U25.4(VOUT+)
NetC131_1: C131.1 PY1.2 R62.1 U26.1(VIN-)
NetC131_2: C131.2 R62.2 R66.1 U26.4(VOUT+)
NetC132_1: C132.1 PZ1.2 R63.1 U27.1(VIN-)
NetC132_2: C132.2 R63.2 R67.1 U27.4(VOUT+)
NetC133_1: C133.1 PW1.2 R64.1 U28.1(VIN-)
NetC133_2: C133.2 R64.2 R68.1 U28.4(VOUT+)
NetC146_1: C146.1 PX2.2 R73.1 U29.1(VIN-)
NetC146_2: C146.2 R73.2 R77.1 U29.4(VOUT+)
NetC147_1: C147.1 PY2.2 R74.1 U30.1(VIN-)
NetC147_2: C147.2 R74.2 R78.1 U30.4(VOUT+)
NetC148_1: C148.1 PZ2.2 R75.1 U31.1(VIN-)
NetC148_2: C148.2 R75.2 R79.1 U31.4(VOUT+)
NetC149_1: C149.1 PW2.2 R76.1 U32.1(VIN-)
NetC149_2: C149.2 R76.2 R80.1 U32.4(VOUT+)
NetC162_1: C162.1 PX3.2 R85.1 U33.1(VIN-)
NetC162_2: C162.2 R85.2 R89.1 U33.4(VOUT+)
NetC163_1: C163.1 PY3.2 R86.1 U34.1(VIN-)
NetC163_2: C163.2 R86.2 R90.1 U34.4(VOUT+)
NetC164_1: C164.1 PZ3.2 R87.1 U35.1(VIN-)
NetC164_2: C164.2 R87.2 R91.1 U35.4(VOUT+)
NetC165_1: C165.1 PW3.2 R88.1 U36.1(VIN-)
NetC165_2: C165.2 R88.2 R92.1 U36.4(VOUT+)
NetC178_1: C178.1 PX4.2 R97.1 U37.1(VIN-)
NetC178_2: C178.2 R97.2 R101.1 U37.4(VOUT+)
NetC179_1: C179.1 PY4.2 R98.1 U38.1(VIN-)
NetC179_2: C179.2 R98.2 R102.1 U38.4(VOUT+)
NetC180_1: C180.1 PZ4.2 R99.1 U39.1(VIN-)
NetC180_2: C180.2 R99.2 R103.1 U39.4(VOUT+)
NetC181_1: C181.1 PW4.2 R100.1 U40.1(VIN-)
NetC181_2: C181.2 R100.2 R104.1 U40.4(VOUT+)
NetC194_1: C194.1 P9.2 R109.1 U41.1(VIN-)
NetC194_2: C194.2 R109.2 R110.1 U41.4(VOUT+)
NetR51_1: R51.1 U15.41(SCK/SCK+)
NetR51_2: R51.2 U15.39(SDO4/SDOD+)
NetR51_3: R51.3 U15.35(SDO3/SDOC+)
NetR51_4: R51.4 U15.33(CLKOUT/CLKOUT+)
NetR52_1: R52.1 U15.29(SDO2/SDOB+)
NetR52_2: R52.2 U15.27(SDO1/SDOA+)
NetR52_3: R52.3 U15.24(*CNV)
NetR53_2: R53.2 U19.14(SDO+)
NetR54_1: R54.1 U16.41(SCK/SCK+)
NetR54_2: R54.2 U16.39(SDO4/SDOD+)
NetR54_3: R54.3 U16.35(SDO3/SDOC+)
NetR54_4: R54.4 U16.33(CLKOUT/CLKOUT+)
NetR55_1: R55.1 U16.29(SDO2/SDOB+)
NetR55_2: R55.2 U16.27(SDO1/SDOA+)
NetR55_3: R55.3 U16.24(*CNV)
NetR56_1: R56.1 U17.41(SCK/SCK+)
NetR56_2: R56.2 U17.39(SDO4/SDOD+)
NetR56_3: R56.3 U17.35(SDO3/SDOC+)
NetR56_4: R56.4 U17.33(CLKOUT/CLKOUT+)
NetR57_1: R57.1 U17.29(SDO2/SDOB+)
NetR57_2: R57.2 U17.27(SDO1/SDOA+)
NetR57_3: R57.3 U17.24(*CNV)
NetR59_1: R59.1 U18.41(SCK/SCK+)
NetR59_2: R59.2 U18.39(SDO4/SDOD+)
NetR59_3: R59.3 U18.35(SDO3/SDOC+)
NetR59_4: R59.4 U18.33(CLKOUT/CLKOUT+)
NetR60_1: R60.1 U18.29(SDO2/SDOB+)
NetR60_2: R60.2 U18.27(SDO1/SDOA+)
NetR60_3: R60.3 U18.24(*CNV)
NetR69_1: R69.1 U25.5(VOUT-)
NetR70_1: R70.1 U26.5(VOUT-)
NetR71_1: R71.1 U27.5(VOUT-)
NetR72_1: R72.1 U28.5(VOUT-)
NetR81_1: R81.1 U29.5(VOUT-)
NetR82_1: R82.1 U30.5(VOUT-)
NetR83_1: R83.1 U31.5(VOUT-)
NetR84_1: R84.1 U32.5(VOUT-)
NetR93_1: R93.1 U33.5(VOUT-)
NetR94_1: R94.1 U34.5(VOUT-)
NetR95_1: R95.1 U35.5(VOUT-)
NetR96_1: R96.1 U36.5(VOUT-)
NetR105_1: R105.1 U37.5(VOUT-)
NetR106_1: R106.1 U38.5(VOUT-)
NetR107_1: R107.1 U39.5(VOUT-)
NetR108_1: R108.1 U40.5(VOUT-)
NetR111_1: R111.1 U41.5(VOUT-)

Not connected (* = marked no-connect by the designer): R52 4* 5*; R53 4* 5*; R55 4* 5*; R57 4* 5*; R60 4* 5*; U15 16(NC)* 17(NC)* 19(NC)* 20(NC)* 28(DNC/SDOA-)* 30(DNC/SDOB-)* 36(DNC/SDOC-)* 40(DNC/SDOD-)* 42(DNC/SCK-)* 47(NC)* 48(NC)* 50(NC)* 51(NC)*; U16 16(NC)* 17(NC)* 19(NC)* 20(NC)* 28(DNC/SDOA-)* 30(DNC/SDOB-)* 36(DNC/SDOC-)* 40(DNC/SDOD-)* 42(DNC/SCK-)* 47(NC)* 48(NC)* 50(NC)* 51(NC)*; U17 16(NC)* 17(NC)* 19(NC)* 20(NC)* 28(DNC/SDOA-)* 30(DNC/SDOB-)* 36(DNC/SDOC-)* 40(DNC/SDOD-)* 42(DNC/SCK-)* 47(NC)* 48(NC)* 50(NC)* 51(NC)*; U18 16(NC)* 17(NC)* 19(NC)* 20(NC)* 28(DNC/SDOA-)* 30(DNC/SDOB-)* 36(DNC/SDOC-)* 40(DNC/SDOD-)* 42(DNC/SCK-)* 47(NC)* 48(NC)* 50(NC)* 51(NC)*; U19 13(SDO-)* 15(SCK-)*

## Notes on the sheet
- (in symbol LTC2325HUKG-16PBF, part A) 1 of 2
- (in symbol LTC2325HUKG-16PBF, part B) 2 of 2

## Library data of the parts
C52-C197 = C: 贴片电容/MLCC电容; BOM名称: 无极性贴片电容; 当前库版本V2023.5.31 @淘宝卖家:黄晶宝石: 最新版本发布https://item.taobao.com/item.htm?id=566775463719
R51-R57 R59 R60 = R-8P4R: 贴片4P排阻; BOM名称: 贴片网络排阻; 当前库版本V2023.5.31 @淘宝卖家:黄晶宝石: 最新版本发布https://item.taobao.com/item.htm?id=566775463719
R58 R61-R111 = R: 贴片电阻; 联系下单店铺卖家 免费帮你查找封装: 联系下单店铺卖家 免费技术支持; BOM名称: 贴片电阻
U15-U18 = LTC2325HUKG-16PBF: No Description Available; Mfr_Name: Analog Devices Inc; RefDes: RefDes; Type: Type
U19 = LTC2311HMSE-16PBF: No Description Available; Mfr_Name: Analog Devices Inc; RefDes: RefDes; Type: Type
U20-U24 = REF1925AIDDCT: No Description Available; Mfr_Name: Texas Instruments; RefDes: RefDes; Type: Type
U25-U41 = OPA862IDR: No Description Available; Mfr_Name: Texas Instruments; TYPE: TYPE; RefDes: RefDes